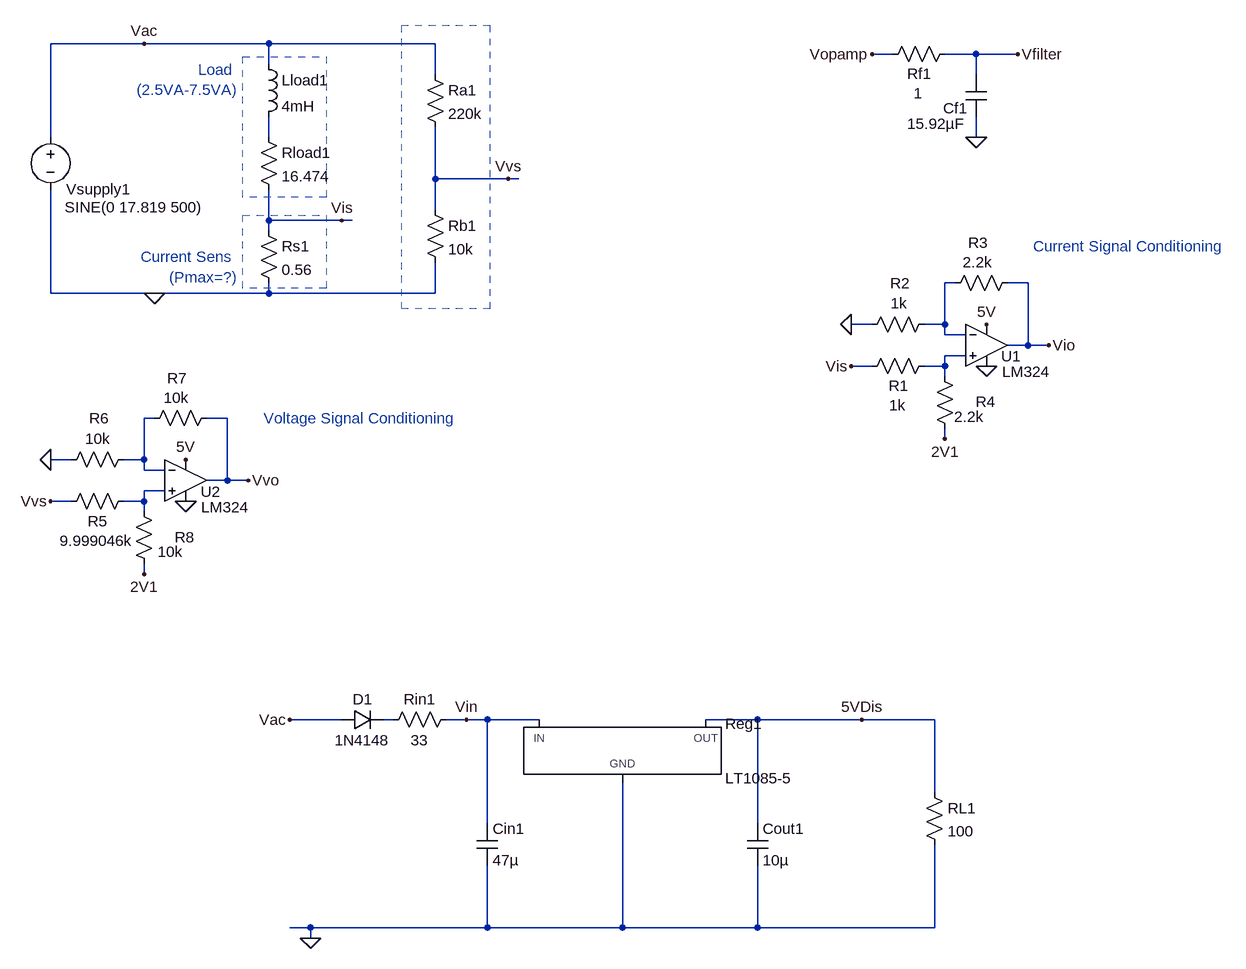
[diagram p0: schematic SchematicsForProject_Harith.asc]
SchematicsForProject_Harith.asc, the LTspice schematic file:
Version 4
SHEET 1 1996 1588
WIRE 304 -688 160 -688
WIRE 496 -688 304 -688
WIRE 752 -688 496 -688
WIRE 1456 -672 1424 -672
WIRE 1584 -672 1536 -672
WIRE 1648 -672 1584 -672
WIRE 496 -656 496 -688
WIRE 752 -640 752 -688
WIRE 1584 -640 1584 -672
WIRE 160 -544 160 -688
WIRE 496 -544 496 -576
WIRE 1584 -544 1584 -576
WIRE 752 -480 752 -560
WIRE 864 -480 752 -480
WIRE 880 -480 864 -480
WIRE 752 -432 752 -480
WIRE 496 -416 496 -464
WIRE 608 -416 496 -416
WIRE 624 -416 608 -416
WIRE 496 -400 496 -416
WIRE 1552 -320 1536 -320
WIRE 1664 -320 1632 -320
WIRE 160 -304 160 -464
WIRE 320 -304 160 -304
WIRE 496 -304 496 -320
WIRE 496 -304 320 -304
WIRE 752 -304 752 -352
WIRE 752 -304 496 -304
WIRE 1424 -256 1392 -256
WIRE 1536 -256 1536 -320
WIRE 1536 -256 1504 -256
WIRE 1536 -240 1536 -256
WIRE 1568 -240 1536 -240
WIRE 1664 -224 1664 -320
WIRE 1664 -224 1632 -224
WIRE 1696 -224 1664 -224
WIRE 1568 -208 1536 -208
WIRE 1424 -192 1392 -192
WIRE 1536 -192 1536 -208
WIRE 1536 -192 1504 -192
WIRE 1536 -176 1536 -192
WIRE 320 -112 304 -112
WIRE 432 -112 400 -112
WIRE 1536 -80 1536 -96
WIRE 192 -48 160 -48
WIRE 304 -48 304 -112
WIRE 304 -48 272 -48
WIRE 304 -32 304 -48
WIRE 336 -32 304 -32
WIRE 432 -16 432 -112
WIRE 432 -16 400 -16
WIRE 464 -16 432 -16
WIRE 336 0 304 0
WIRE 192 16 160 16
WIRE 304 16 304 0
WIRE 304 16 272 16
WIRE 304 32 304 16
WIRE 304 128 304 112
WIRE 608 352 528 352
WIRE 688 352 672 352
WIRE 800 352 768 352
WIRE 832 352 800 352
WIRE 912 352 832 352
WIRE 1248 352 1168 352
WIRE 1408 352 1248 352
WIRE 1520 352 1408 352
WIRE 1520 464 1520 352
WIRE 832 512 832 352
WIRE 1248 512 1248 352
WIRE 560 672 528 672
WIRE 832 672 832 576
WIRE 832 672 560 672
WIRE 1040 672 1040 448
WIRE 1040 672 832 672
WIRE 1248 672 1248 576
WIRE 1248 672 1040 672
WIRE 1520 672 1520 544
WIRE 1520 672 1248 672
WIRE 560 688 560 672
FLAG 320 -304 0
FLAG 304 -688 Vac
FLAG 608 -416 Vis
FLAG 864 -480 Vvs
FLAG 1584 -544 0
FLAG 1424 -672 Vopamp
FLAG 1648 -672 Vfilter
FLAG 1600 -192 0
FLAG 1600 -256 5V
FLAG 1392 -192 Vis
FLAG 1392 -256 0
FLAG 1696 -224 Vio
FLAG 1536 -80 2V1
FLAG 368 16 0
FLAG 368 -48 5V
FLAG 160 16 Vvs
FLAG 160 -48 0
FLAG 464 -16 Vvo
FLAG 304 128 2V1
FLAG 560 688 0
FLAG 528 352 Vac
FLAG 1408 352 5VDis
FLAG 800 352 Vin
SYMBOL voltage 160 -560 R0
WINDOW 0 24 96 Left 2
WINDOW 3 22 124 Left 2
WINDOW 123 0 0 Left 0
WINDOW 39 0 0 Left 0
SYMATTR InstName Vsupply1
SYMATTR Value SINE(0 17.819 500)
SYMBOL res 480 -560 R0
SYMATTR InstName Rload1
SYMATTR Value 16.474
SYMBOL ind 480 -672 R0
SYMATTR InstName Lload1
SYMATTR Value 4mH
SYMBOL res 480 -416 R0
SYMATTR InstName Rs1
SYMATTR Value 0.56
SYMBOL res 736 -656 R0
SYMATTR InstName Ra1
SYMATTR Value 220k
SYMBOL res 736 -448 R0
SYMATTR InstName Rb1
SYMATTR Value 10k
SYMBOL res 1552 -688 R90
WINDOW 0 62 55 VBottom 2
WINDOW 3 61 57 VTop 2
SYMATTR InstName Rf1
SYMATTR Value 1
SYMBOL cap 1600 -576 R180
WINDOW 0 29 13 Left 2
WINDOW 3 33 -11 Left 2
SYMATTR InstName Cf1
SYMATTR Value 15.92µF
SYMBOL Opamps/opamp2 1600 -288 R0
WINDOW 0 23 81 Left 2
WINDOW 3 24 105 Left 2
SYMATTR InstName U1
SYMATTR Value LM324
SYMBOL res 1520 -208 R90
WINDOW 0 62 55 VBottom 2
WINDOW 3 61 57 VTop 2
SYMATTR InstName R1
SYMATTR Value 1k
SYMBOL res 1520 -272 R90
WINDOW 0 -32 53 VBottom 2
WINDOW 3 -32 55 VTop 2
SYMATTR InstName R2
SYMATTR Value 1k
SYMBOL res 1648 -336 R90
WINDOW 0 -30 61 VBottom 2
WINDOW 3 -31 62 VTop 2
SYMATTR InstName R3
SYMATTR Value 2.2k
SYMBOL res 1552 -80 R180
WINDOW 0 -62 57 Left 2
WINDOW 3 -44 34 Left 2
SYMATTR InstName R4
SYMATTR Value 2.2k
SYMBOL Opamps/opamp2 368 -80 R0
WINDOW 0 23 81 Left 2
WINDOW 3 24 105 Left 2
SYMATTR InstName U2
SYMATTR Value LM324
SYMBOL res 288 0 R90
WINDOW 0 62 55 VBottom 2
WINDOW 3 61 57 VTop 2
SYMATTR InstName R5
SYMATTR Value 9.999046k
SYMBOL res 288 -64 R90
WINDOW 0 -32 53 VBottom 2
WINDOW 3 -32 55 VTop 2
SYMATTR InstName R6
SYMATTR Value 10k
SYMBOL res 416 -128 R90
WINDOW 0 -30 61 VBottom 2
WINDOW 3 -31 62 VTop 2
SYMATTR InstName R7
SYMATTR Value 10k
SYMBOL res 320 128 R180
WINDOW 0 -62 57 Left 2
WINDOW 3 -44 34 Left 2
SYMATTR InstName R8
SYMATTR Value 10k
SYMBOL PowerProducts/LT1085-5 1040 352 R0
SYMATTR InstName Reg1
SYMBOL res 1504 448 R0
SYMATTR InstName RL1
SYMATTR Value 100
SYMBOL res 784 336 R90
WINDOW 0 0 56 VBottom 2
WINDOW 3 32 56 VTop 2
SYMATTR InstName Rin1
SYMATTR Value 33
SYMBOL diode 608 368 R270
WINDOW 0 32 32 VTop 2
WINDOW 3 0 32 VBottom 2
SYMATTR InstName D1
SYMATTR Value 1N4148
SYMBOL cap 816 512 R0
SYMATTR InstName Cin1
SYMATTR Value 47µ
SYMATTR SpiceLine Rser=0.001
SYMBOL cap 1232 512 R0
SYMATTR InstName Cout1
SYMATTR Value 10µ
SYMATTR SpiceLine Rser=0.001
TEXT 448 -648 Right 2 ;Load \n(2.5VA-7.5VA)
TEXT 448 -360 Right 2 ;Current Sens \n(Pmax=?)
TEXT 1672 -376 Left 2 ;Current Signal Conditioning
TEXT 488 -112 Left 2 ;Voltage Signal Conditioning
RECTANGLE Normal 456 -668 584 -452 2
RECTANGLE Normal 456 -424 584 -312 2
RECTANGLE Normal 700 -716 836 -280 2

The netlist it stands for:
* SchematicsForProject_Harith.asc
Vsupply1 Vac 0 SINE(0 17.819 500)
Rload1 N001 Vis 16.474
Lload1 Vac N001 4mH
Rs1 Vis 0 0.56
Ra1 Vac Vvs 220k
Rb1 Vvs 0 10k
Rf1 Vfilter Vopamp 1
Cf1 0 Vfilter 15.92µF
XU1 N003 N002 5V 0 Vio LM324  ; pins In+ In- V+ V- OUT
R1 N003 Vis 1k
R2 N002 0 1k
R3 Vio N002 2.2k
R4 2V1 N003 2.2k
XU2 N005 N004 5V 0 Vvo LM324  ; pins In+ In- V+ V- OUT
R5 N005 Vvs 9.999046k
R6 N004 0 10k
R7 Vvo N004 10k
R8 2V1 N005 10k
XReg1 0 5VDis Vin LT1085-5  ; pins GND OUT IN
RL1 5VDis 0 100
Rin1 Vin N006 33
D1 Vac N006 1N4148
Cin1 Vin 0 47µ Rser=0.001
Cout1 5VDis 0 10µ Rser=0.001
.model D D
.lib standard.dio
* Load
* (2.5VA-7.5VA)
* Current Sens
* (Pmax=?)
* Current Signal Conditioning
* Voltage Signal Conditioning
.backanno
.end